# EAGLE design vbus (EAGLE 6.5.0)
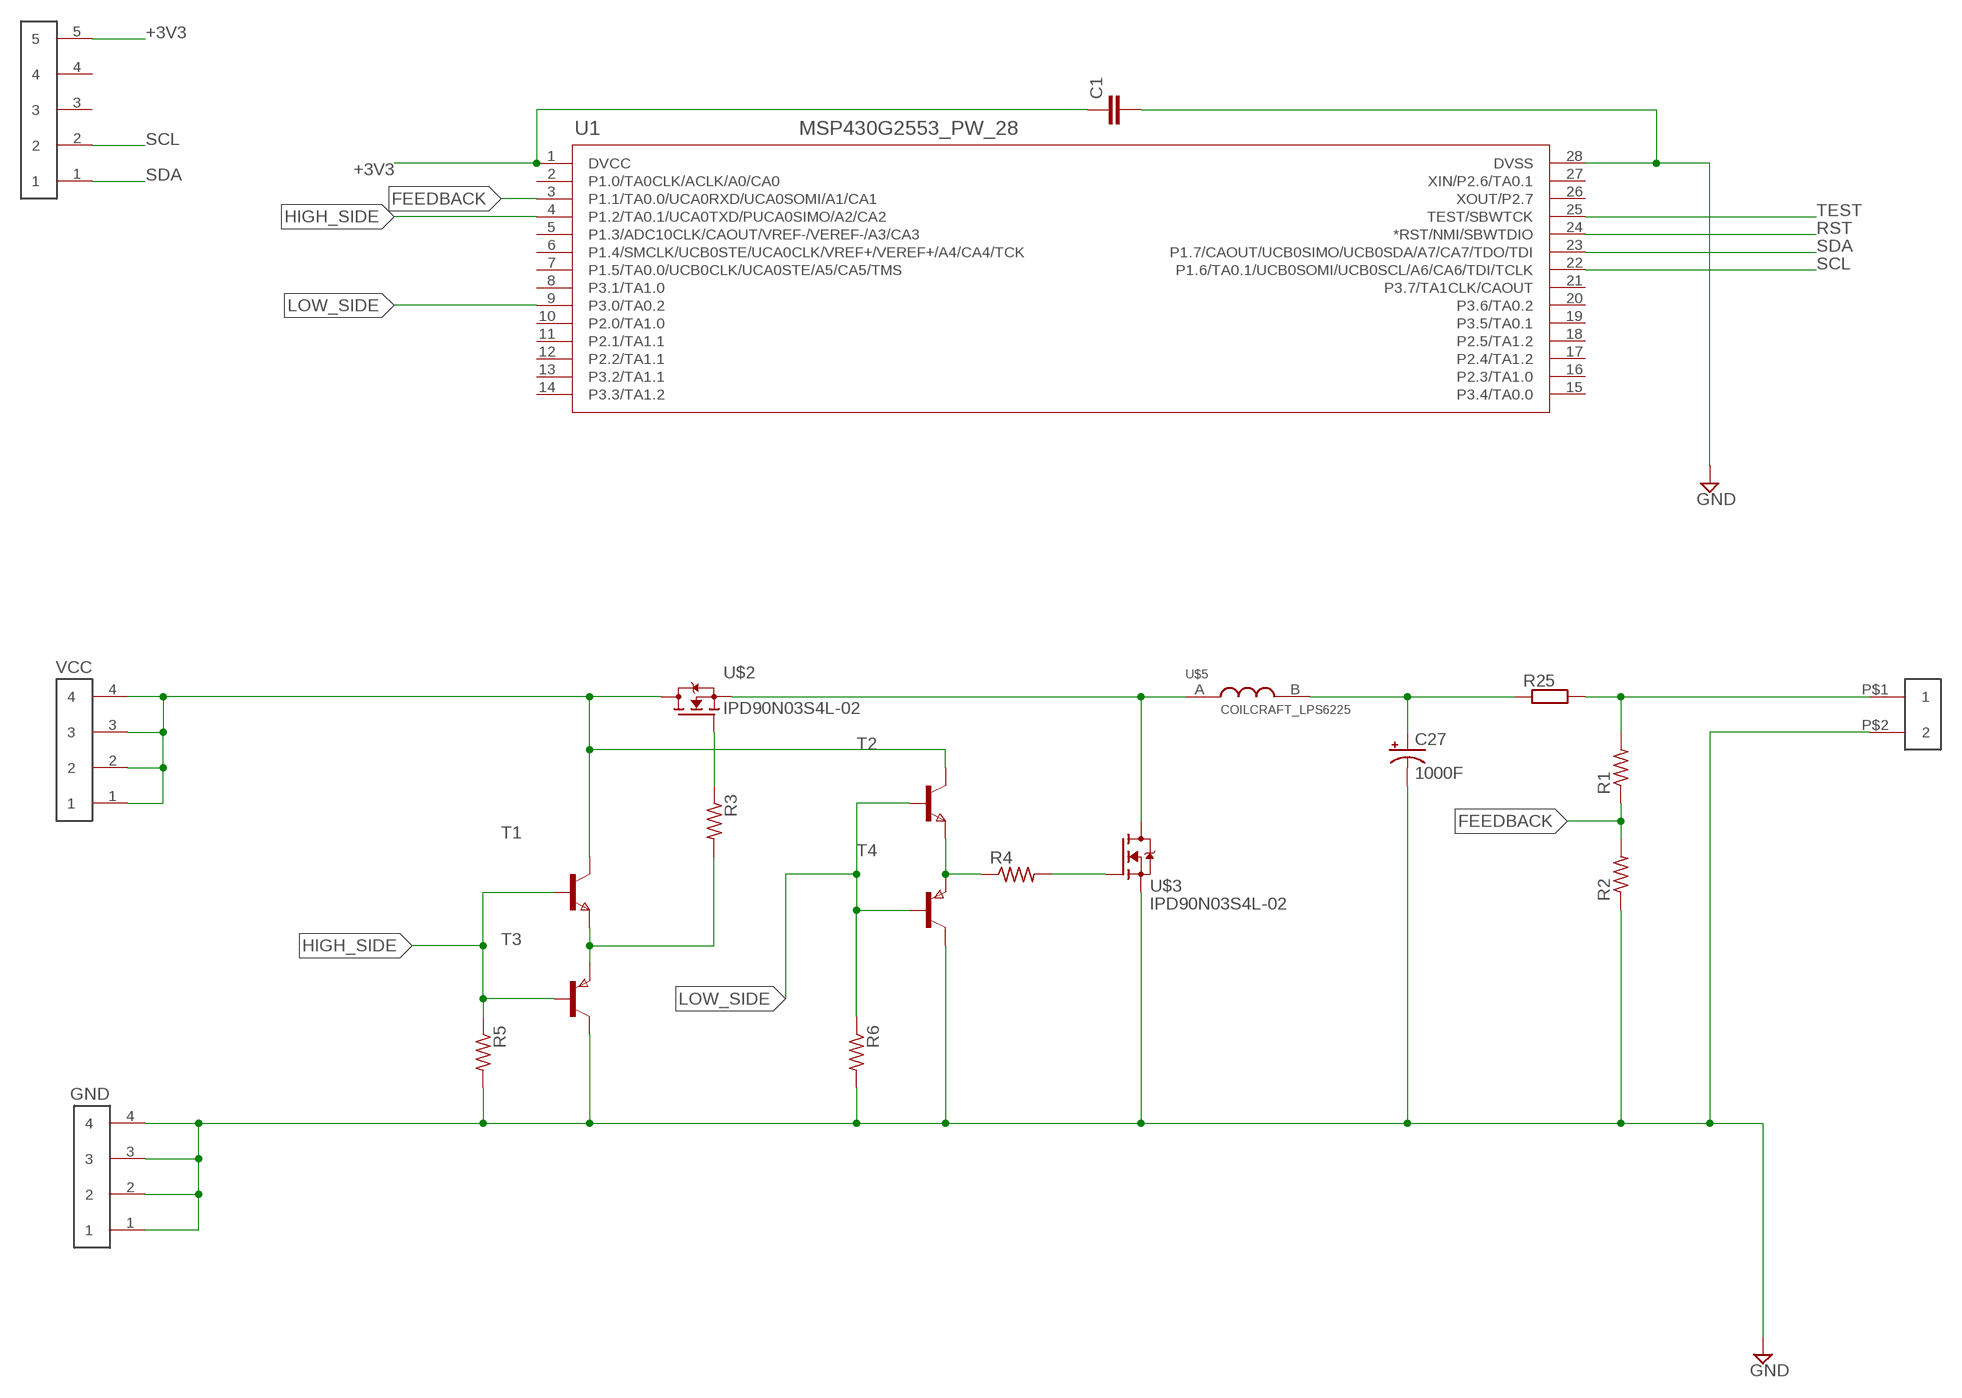
[diagram p0: schematic, sheet 1]

## Parts
C1  C-EUC0603  [C0603]
C27  1000F  CPOL-USTAP5-60  [TAP5-60]
R1  R-US_R1206  [R1206]
R2  R-US_R1206  [R1206]
R3  R-US_R1206  [R1206]
R4  R-US_R1206  [R1206]
R5  R-US_R1206  [R1206]
R6  R-US_R1206  [R1206]
R25  SMR  [SMR]
T1  NPNSOT23-6  [SOT23-6]
T2  NPNSOT23-6  [SOT23-6]
T3  PNPSOT23-6  [SOT23-6]
T4  PNPSOT23-6  [SOT23-6]
U1  MSP430G2553_PW_28  [PW28]
U$2  IPD90N03S4L-02  [P/PG-TO252-3-11]
U$3  IPD90N03S4L-02  [P/PG-TO252-3-11]
U$4  1X5_HEADER  [1X5-.1HEADER]
U$5  COILCRAFT_LPS6225  [INDUCTOR]
U$11  1X4_HEADER  [1X4-.1HEADER]
U$12  1X4_HEADER  [1X4-.1HEADER]
VBUS  MOLEX-0436500200  [MOLEX_MICROFIT-2]

## Nets
+3V3: C1.1 U1.1(DVCC) U$4.5
FEEDBACK: R1.1 R2.2 U1.3(P1.1/TA0.0/UCA0RXD/UCA0SOMI/A1/CA1)
GND: C1.2 C27.- R2.1 R5.2 R6.2 T3.1(C) T3.2(C) T3.5(C) T3.6(C) T4.1(C) T4.2(C) T4.5(C) T4.6(C) U1.28(DVSS) U$3.3(S) U$12.1 U$12.2 U$12.3 U$12.4 VBUS.P$2
HIGH_SIDE: R5.1 T1.3(B) T3.3(B) U1.4(P1.2/TA0.1/UCA0TXD/PUCA0SIMO/A2/CA2)
LOW_SIDE: R6.1 T2.3(B) T4.3(B) U1.9(P3.0/TA0.2)
N$1: R3.1 U$2.1(G)
N$2: U$2.3(S) U$3.2(D) U$5.A
N$3: R1.2 R25.1 VBUS.P$1
N$4: R3.2 T1.4(E) T3.4(E)
N$5: R4.2 U$3.1(G)
N$6: R4.1 T2.4(E) T4.4(E)
RST: U1.24(*RST/NMI/SBWTDIO)
SCL: U1.22(P1.6/TA0.1/UCB0SOMI/UCB0SCL/A6/CA6/TDI/TCLK) U$4.2
SDA: U1.23(P1.7/CAOUT/UCB0SIMO/UCB0SDA/A7/CA7/TDO/TDI) U$4.1
TEST: U1.25(TEST/SBWTCK)
VBUS: C27.+ R25.2 U$5.B
VCC: T1.1(C) T1.2(C) T1.5(C) T1.6(C) T2.1(C) T2.2(C) T2.5(C) T2.6(C) U$2.2(D) U$11.1 U$11.2 U$11.3 U$11.4
Unconnected: U1.2(P1.0/TA0CLK/ACLK/A0/CA0) U1.5(P1.3/ADC10CLK/CAOUT/VREF-/VEREF-/A3/CA3) U1.6(P1.4/SMCLK/UCB0STE/UCA0CLK/VREF+/VEREF+/A4/CA4/TCK) U1.7(P1.5/TA0.0/UCB0CLK/UCA0STE/A5/CA5/TMS) U1.8(P3.1/TA1.0) U1.10(P2.0/TA1.0) U1.11(P2.1/TA1.1) U1.12(P2.2/TA1.1) U1.13(P3.2/TA1.1) U1.14(P3.3/TA1.2) U1.15(P3.4/TA0.0) U1.16(P2.3/TA1.0) U1.17(P2.4/TA1.2) U1.18(P2.5/TA1.2) U1.19(P3.5/TA0.1) U1.20(P3.6/TA0.2) U1.21(P3.7/TA1CLK/CAOUT) U1.26(XOUT/P2.7) U1.27(XIN/P2.6/TA0.1) U$4.3 U$4.4

## Library data of the parts
C1 = rcl:C-EU: CAPACITOR, European symbol
C27 = resistor:CPOL-US: POLARIZED CAPACITOR, American symbol
R1-R6 = resistor:R-US_: RESISTOR, American symbol
R25 = resistor-shunt:SMR: SMD SHUNT RESISTOR; OC_FARNELL: unknown; OC_NEWARK: unknown
T1 T2 = zetex:NPNSOT23-6: NPN TRANSISTOR; MPN: ZXT13N50DE6; OC_FARNELL: 9525394; OC_NEWARK: 98K4165
T3 T4 = zetex:PNPSOT23-6: PNP TRANSISTOR; MPN: ZXT13P12DE6; OC_FARNELL: 1471192RL; OC_NEWARK: 70K9269
U1 = TexasInstruments:MSP430G2553_PW_28; DATASHEETURL: http://www.ti.com/lit/gpn/MSP430G2553; DESCRIPTION: MSP430G2x53, MSP430G2x13 Mixed Signal Microcontroller; FAMILY_NAME: Value Line; GENERIC_PART_NUMBER: MSP430G2553; INDUSTRY_STD_PKG_TYPE: TSSOP; MANUFACTURER: Texas Instruments; MANUFACTURER_PART_NUMBER: msp430g2553_pw_28; PACKAGE_DESIGNATOR: PW; PIN_COUNT: 28; VENDOR: Texas Instruments
U$2 U$3 = misc_passives:IPD90N03S4L-02
U$4 = connectors:1X5_HEADER
U$5 = misc_passives:COILCRAFT_LPS6225
U$11 U$12 = connectors:1X4_HEADER
VBUS = connectors:MOLEX-0436500200

## Board
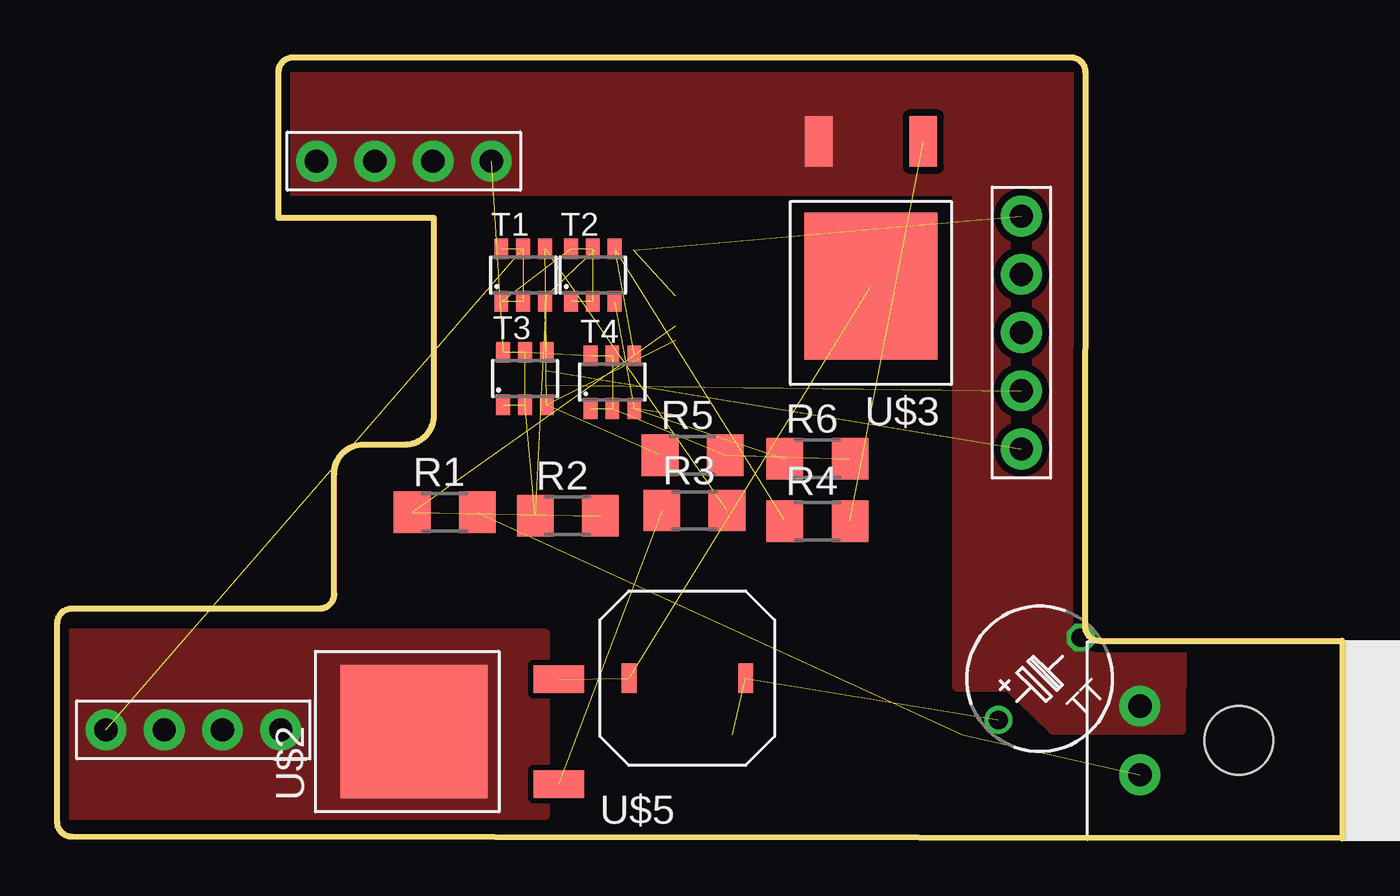
[diagram p1: board, top side]
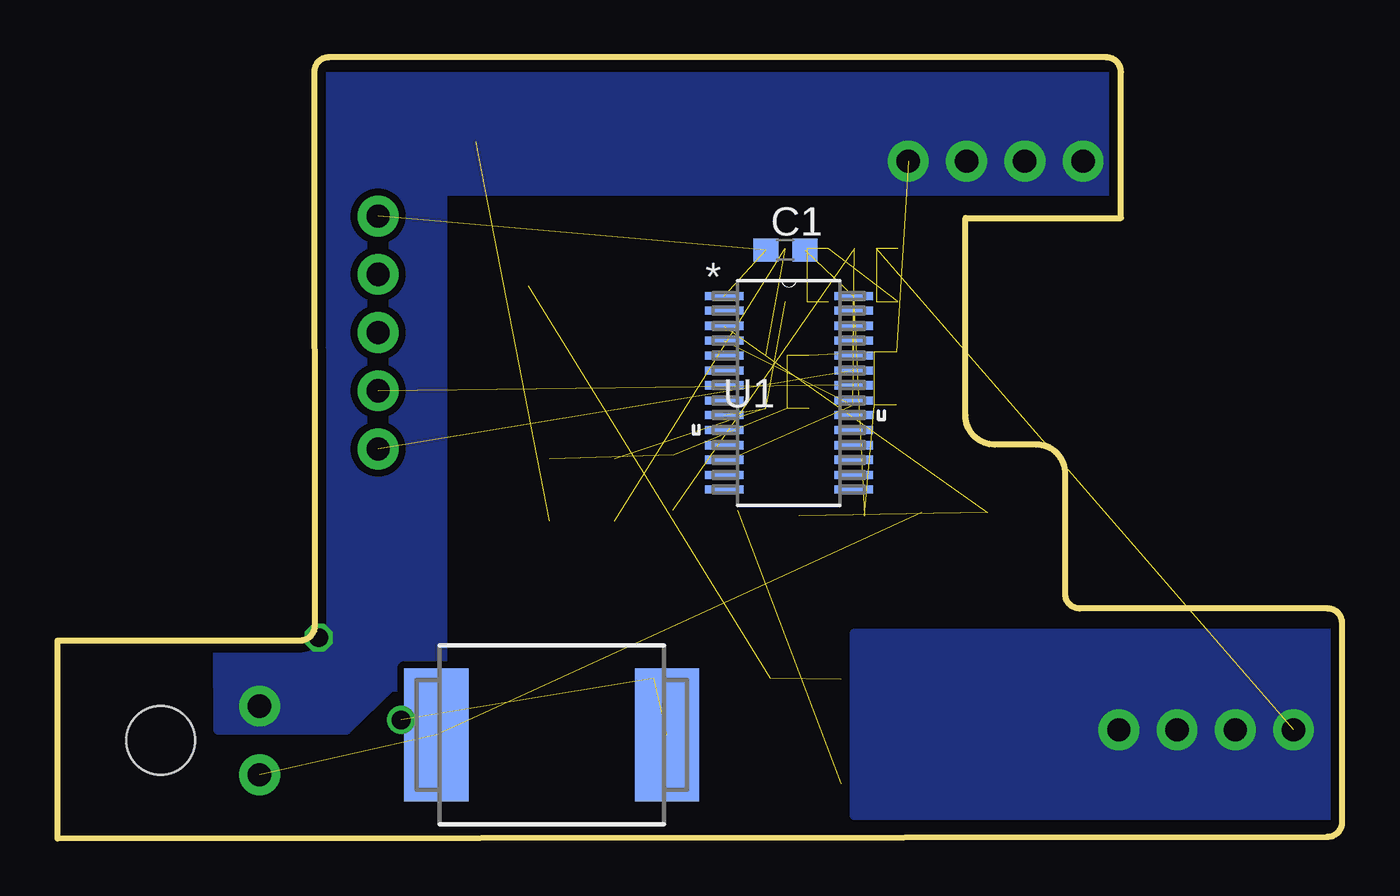
[diagram p2: board, bottom side, seen from below]

Size 56.01 x 34.06 mm. Coordinates in mm from the lower left corner, seen from the top.
Outline: 56.01,0 0.63,0.08 arc-90 0,0.71 0,9.4 arc-90 0.63,10.03 11.44,10.03 arc90 12.08,10.67 12.07,15.91 arc-90 13.34,17.18 15.15,17.18 arc90 16.42,18.45 16.42,27.05 9.65,27.05 9.65,33.43 arc-90 10.28,34.06 44.18,34.06 arc-90 44.82,33.43 44.8,9.26 arc90 45.44,8.63 56.01,8.63 56.01,0
Copper layers (1*16): Top 0.0356mm / dielectric 1.5011mm / Bottom 0.0356mm
Design rules "oshpark": minimum track width 6mil, minimum drill 13mil, track to track 6mil, track to pad 6mil, pad to pad 6mil, via to via 6mil, smd to smd 6mil, copper to edge 15mil, drill to drill 6mil, minimum pad ring 7mil, minimum via ring 7mil, stop-mask expansion 4mil, vias tented up to drill 0mil, thermal gap 10mil

### Footprints (pad centres in the part's own frame; a part is rotated, then mirrored left to right if it is on the bottom)
C0603 = smd 1.1 x 1: 1 -0.85,0; 2 0.85,0
TAP5-60 = drill 0.813: + -2.54,0 | drill 0.813 octagon: - 2.54,0
R1206 = smd 1.6 x 1.803: 1 -1.422,0; 2 1.422,0
SMR = smd 2.8 x 5.8: 1 5.029,0; 2 -5.029,0
SOT23-6 = smd 0.6 x 0.9: 1 -0.95,-1.15; 2 0,-1.15; 3 0.95,-1.15; 4 0.95,1.15; 5 0,1.15; 6 -0.95,1.15
PW28 = smd 1.676 x 0.356: 1 -2.819,4.216; 2 -2.819,3.581; 3 -2.819,2.921; 4 -2.819,2.286; 5 -2.819,1.626; 6 -2.819,0.965; 7 -2.819,0.33; 8 -2.819,-0.33; 9 -2.819,-0.965; 10 -2.819,-1.626; 11 -2.819,-2.286; 12 -2.819,-2.921; 13 -2.819,-3.581; 14 -2.819,-4.216; 15 2.819,-4.216; 16 2.819,-3.581; 17 2.819,-2.921; 18 2.819,-2.286; 19 2.819,-1.626; 20 2.819,-0.965; 21 2.819,-0.33; 22 2.819,0.33; 23 2.819,0.965; 24 2.819,1.626; 25 2.819,2.286; 26 2.819,2.921; 27 2.819,3.581; 28 2.819,4.216
P/PG-TO252-3-11 = smd 1.2 x 2.2: 1 -2.28,-3.1; 3 2.28,-3.1 | smd 5.8 x 6.4: 2 0,3.2
1X5-.1HEADER = drill 1.016 pad 1.778: 1 -2.54,0; 2 0,0; 3 2.54,0; 4 5.08,0; 5 7.62,0
INDUCTOR = smd 0.635 x 1.27: A -2.54,0; B 2.54,0
1X4-.1HEADER = drill 1.016 pad 1.778: 1 -5.08,0; 2 -2.54,0; 3 0,0; 4 2.54,0
MOLEX_MICROFIT-2 = drill 1.016 pad 1.778: P$1 -1.499,4.318; P$2 1.499,4.318 | hole 2.997: 0,0

### Placement (x,y rotation side)
C1  24.28,25.65 0 bottom
C27  42.83,6.96 45 top
R1  16.89,14.22 0 top
R2  22.25,14.07 0 top
R3  27.77,14.3 0 top
R4  33.14,13.84 0 top
R5  27.7,16.71 0 top
R6  33.14,16.56 0 top
R25  34.46,4.52 180 bottom
T1  20.31,24.57 0 top
T2  23.34,24.57 0 top
T3  20.39,20.06 0 top
T4  24.2,19.9 0 top
U1  24.12,19.43 0 bottom
U$2  18.75,4.66 90 top
U$3  35.47,27.29 180 top
U$4  42.03,19.52 90 top
U$5  27.46,6.99 0 top
U$11  7.2,4.73 0 top
U$12  16.38,29.53 0 top
VBUS  51.52,4.28 90 top

### Tracks (layer width: path | path; a pad name or v marks a point on that pad's centre or on a via)
+3V3  (2 unrouted)
FEEDBACK  (2 unrouted)
GND  (13 unrouted)
  pour Top (isolate 0.305, rank 2, no thermals): 9.98,33.21 44.6,33.21 44.88,8.7 49.03,8.7 49.03,6.61 49,6.61 49,4.74 45.42,4.74 43.4,4.74 41.46,6.6 39.23,6.61 39.23,28.23 9.98,28.23
  pour Bottom (isolate 0.305, rank 2, no thermals): 9.98,33.21 44.6,33.21 44.88,8.7 49.03,8.7 49.03,6.61 49,6.61 49,4.74 45.42,4.74 43.4,4.74 41.46,6.6 39.23,6.61 39.23,28.23 9.98,28.23
HIGH_SIDE  (3 unrouted)
LOW_SIDE  (3 unrouted)
N$1  (1 unrouted)
N$2  (2 unrouted)
N$3  (2 unrouted)
N$4  (2 unrouted)
N$5  (1 unrouted)
N$6  (2 unrouted)
SCL  (1 unrouted)
SDA  (1 unrouted)
VBUS  (2 unrouted)
VCC  (8 unrouted)
  pour Top (isolate 0.254, no thermals): 21.26,8.94 0.02,8.94 0.02,1.01 21.26,1.01
  pour Bottom (isolate 0.254, no thermals): 21.26,8.94 0.02,8.94 0.02,1.01 21.26,1.01